# Altium schematic sheet Voltage_Sens.SchDoc
size A4; SheetNumber: 4; SheetTotal: 5; SPICEModelCacheLAJQXVES: <root> / <DocumentId>LAJQXVES</DocumentId> / <CacheFrame Number="0"> / <Model Name="3818_74406032220_22u" Kind="CKT"> / <Text>******* / .subckt 3818_74406032220_22u 1 2 / Rp 1 2 9156.93522 / Cp 1 2 0.884349082p / Rs 1 N3 0.401 / L1 N3 2 22.9186456u / .ends 3818_74406032220_22u</Text> / </Model> / </CacheFrame> / </root>
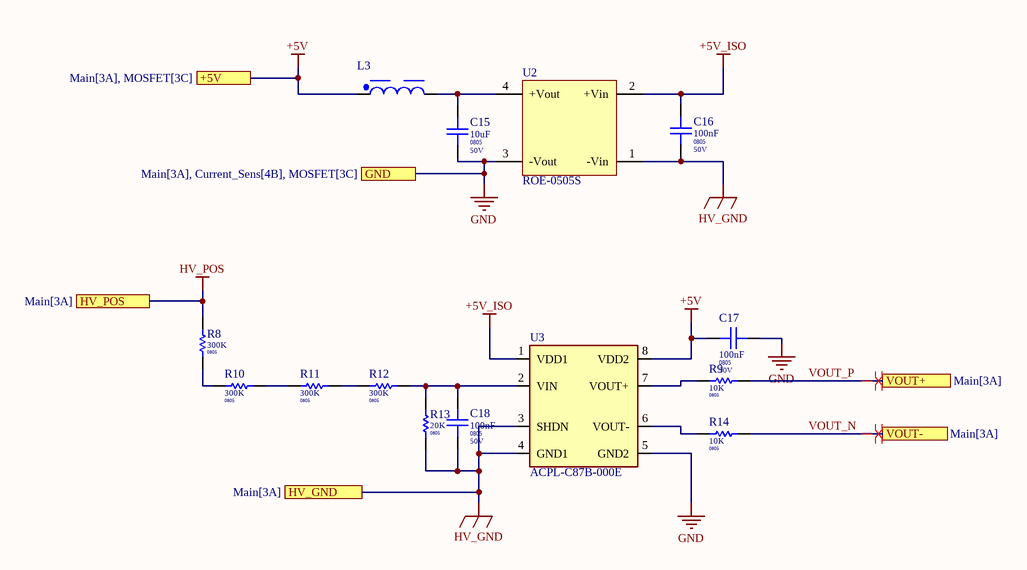
[diagram p0: Voltage_Sens.SchDoc]

## Parts
C15  Package / Case: 0805  Voltage: 50V  [CAPC 0805]  (hidden comment: 10uF)
C16  Package / Case: 0805  Voltage: 50V  [CAPC 0805]  (hidden comment: 100nF)
C17  Package / Case: 0805  Voltage: 50V  [CAPC 0805]  (hidden comment: 100nF)
C18  Package / Case: 0805  Voltage: 50V  [CAPC 0805]  (hidden comment: 100nF)
L3  22uH, 0.66A  [WE-LQFS_3818]  (value not drawn)
R8  Package / Case: 0805  [RESC 0805]  (hidden comment: 300K)
R9  Package / Case: 0805  [RESC 0805]  (hidden comment: 10K)
R10  Package / Case: 0805  [RESC 0805]  (hidden comment: 300K)
R11  Package / Case: 0805  [RESC 0805]  (hidden comment: 300K)
R12  Package / Case: 0805  [RESC 0805]  (hidden comment: 300K)
R13  Package / Case: 0805  [RESC 0805]  (hidden comment: 20K)
R14  Package / Case: 0805  [RESC 0805]  (hidden comment: 10K)
U2  ROE-0505S  [CONV_ROE-0505S]
U3  ACPL-C87B-000E  [SOIC127P1150X320-8N]

## Ports
+5V (see Main[3A], MOSFET[3C]), GND (see Main[3A], Current_Sens[4B], MOSFET[3C]), HV_GND (see Main[3A]), HV_POS (see Main[3A]), VOUT+ (see Main[3A]), VOUT- (see Main[3A])

## Nets
+5V: C17.2 L3.1 U3.8(VDD2) ; port +5V
+5V_ISO: C16.2 U2.2(+Vin) U3.1(VDD1)
GND: C15.1 C17.1 U2.3(-Vout) U3.5(GND2) ; port GND
HV_GND: C16.1 C18.1 R13.1 U2.1(-Vin) U3.3(SHDN) U3.4(GND1) ; port HV_GND
HV_POS: R8.2 ; port HV_POS
VOUT_N: R14.2 ; port VOUT-
VOUT_P: R9.2 ; port VOUT+
NetC15_2: C15.2 L3.2 U2.4(+Vout)
NetC18_2: C18.2 R12.1 R13.2 U3.2(VIN)
NetR8_1: R8.1 R10.2
NetR9_1: R9.1 U3.7(VOUT+)
NetR10_1: R10.1 R11.2
NetR11_1: R11.1 R12.2
NetR14_1: R14.1 U3.6(VOUT-)

## Layout directives
differential pair: VOUT_N, VOUT_P

## Library data of the parts
C15 = CAPC0588: Capacitor Ceramic 10uF 50V 0805; Tolerance: %10; Value Rating: uF; Value: 10uF; Part Number: CAPC0588; Category: Capacitor Ceramic; Values: 10uF 50V
C16-C18 = CAPC0572: Capacitor Ceramic 100nF 50V 0805; Tolerance: %10; Value Rating: nF; Favorites: Favorite; Value: 100nF; Part Number: CAPC0572; Category: Capacitor Ceramic; Values: 100nF 50V
L3 = 74406032220: WE-LQFS SMT Power Inductor, size 3818, 22uH, 0.66A, 481mOhm; Manufacturer: Wurth Elektronik; Case/Size Code: 3818; DC Resistance: 401mOhm; Saturation Current: 0.46A; Self Resonant Frequency: 37MHz; Manufacturer Part Number: 74406032220; Category: Power Inductors; Match Code: WE-LQFS; ComponentLink1Description: Website Link; ComponentLink1URL: https://www.we-online.com/redexpert/article/74406032220?ad; ComponentLink2Description: Datasheet Link; ComponentLink2URL: https://www.we-online.com/redexpert/spec/74406032220?ad; Mount: Surface Mount; Min Operating Temperature: -40°C; Max Operating Temperature: 125°C; Packaging: Tape and Reel; Length: 3.8mm; Width: 3.8mm; Height: 1.8mm; DC Resistance Max: 481mOhm; Inductance: 22uH; Rated Current: 0.66A
R8 R10-R12 = R0401: 300K 0805; Part Number: R0401; Tolerance: %5; Power: 1/10W; Value: 300K; Category: Resistor; Values: 300K
R9 R14 = R0366: 10K 0805; Part Number: R0366; Tolerance: %5; Power: 1/10W; Value: 10K; Category: Resistor; Values: 10K
R13 = R0373: 20K 0805; Part Number: R0373; Tolerance: %5; Power: 1/10W; Value: 20K; Category: Resistor; Values: 20K
U2 = ROE-0505S: DC DC CONVERTER 5V 1W; Manufacturer 1: Recom; Manufacturer Part Number 1: ROE-1205S; Number of Outputs: 1; Min Input Voltage: 10.8V; Max Input Voltage: 13.2V; Max Output Current: 200mA; Isolation Voltage: 1kV; Efficiency: 80%; Supplier 1: Digi-Key; Description 1: DC DC CONVERTER 5V 1W; Stock 1: 1769; Pricing 1: 1=2,94000, 5=2,89800, 10=2,85600, 25=2,77200, 50=2,68800, 100=2,60400, 250=2,52000, 500=2,35200 (USD); RoHS: Yes; Mount: Through Hole; Case/Package: SIP; Weight: 1.4g; Min Operating Temperature: -40°C; Max Operating Temperature: 85°C; Packaging: Rail/Tube; Voltage - Output 1: 5V; Max Power Dissipation: 1W; Max Output Voltage: 5V; Length: 11.5mm; Height: 10mm; Width: 6mm; Lead Free: Lead Free; ComponentLink1URL: http://www.farnell.com/datasheets/1960995.pdf?src-supplier=Newark; ComponentLink1Description: http://www.farnell.com/datasheets/1960995.pdf?src-supplier=Newark; ComponentLink2URL: https://www.recom-power.com/pdf/Econoline/ROE.pdf?src-supplier=Digi-Key; ComponentLink2Description: https://www.recom-power.com/pdf/Econoline/ROE.pdf?src-supplier=Digi-Key; Supplier Part Number 1: ROE-1205S-ND
U3 = ACPL-C87B-000E: Isolation Amplifier 1 Circuit Differential 8-SO; MF: Broadcom Limited; SnapEDA_Link: https://www.snapeda.com/parts/ACPL-C87B-000E/Broadcom%20Limited/view-part/1969988/?ref=snap; Availability: Unavailable; MP: ACPL-C87B-000E; Value: *; Price: None; Package: SO-8 Broadcom